# Altium schematic sheet PowerModul.SchDoc
size A3
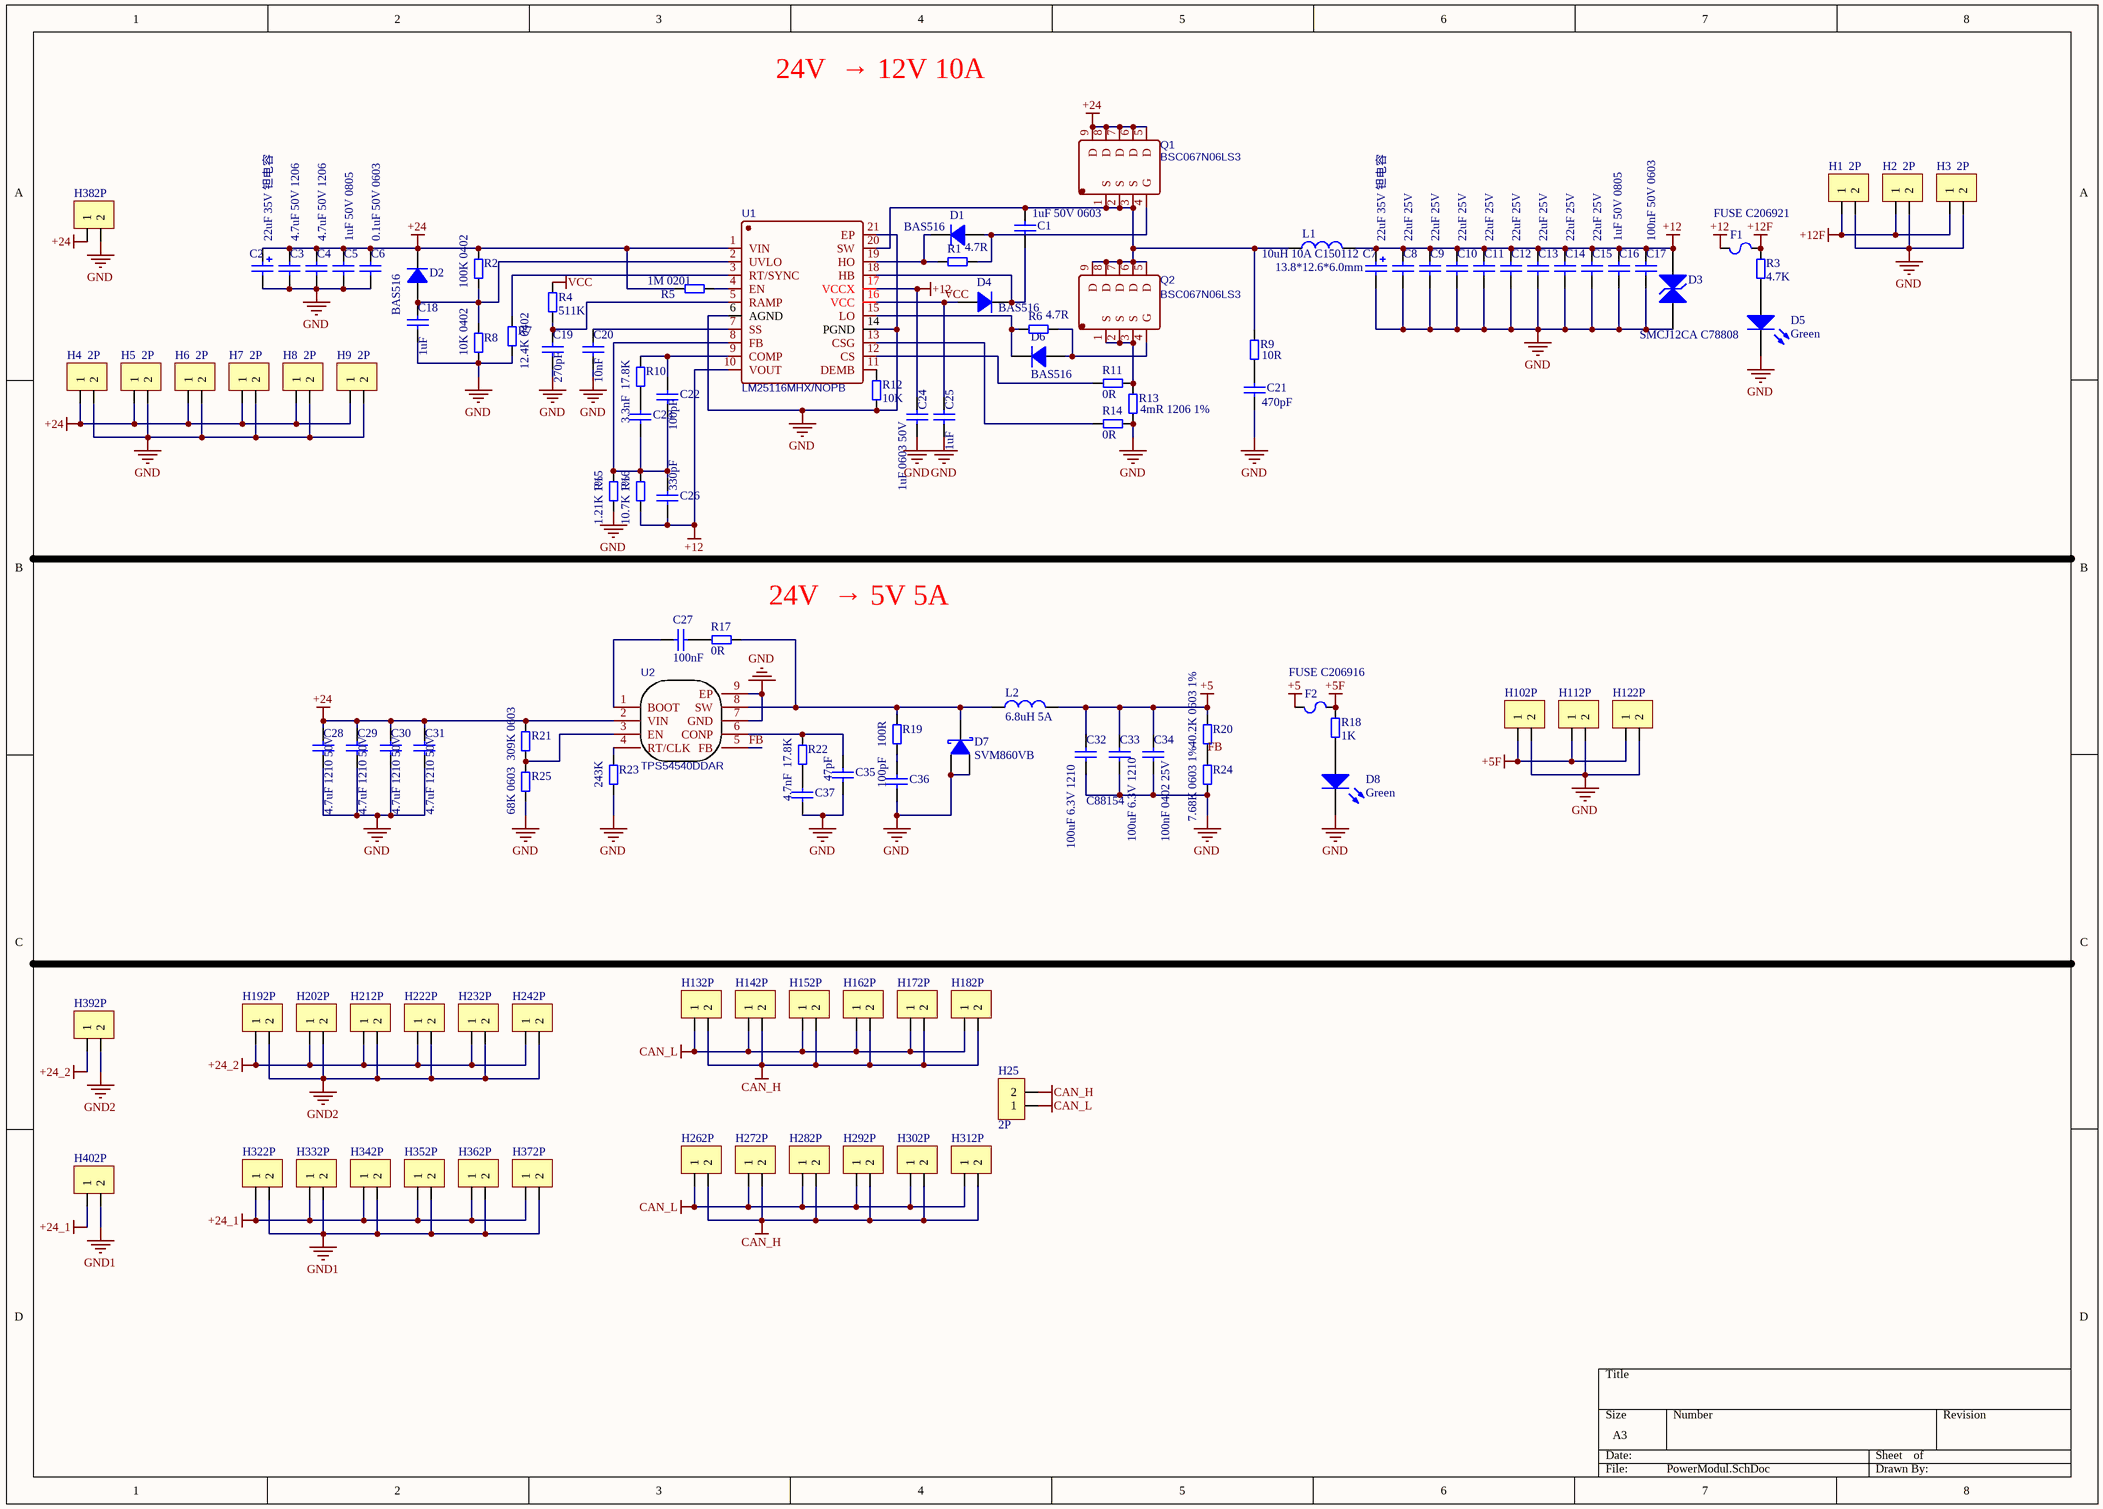
[diagram p0: PowerModul.SchDoc]

## Parts
C1  1uF 50V 0603  [0603_C]
C2  22uF 35V 钽电容  [CAP-SMD_L7.3-W4.3-R-RD]
C3  4.7uF 50V 1206  [1206_C]
C4  4.7uF 50V 1206  [1206_C]
C5  1uF 50V 0805  [0805_C]
C6  0.1uF 50V 0603  [0603_C]
C7  22uF 35V 钽电容  [CAP-SMD_L7.3-W4.3-R-RD]
C8  22uF 25V  [1206_C]
C9  22uF 25V  [1206_C]
C10  22uF 25V  [1206_C]
C11  22uF 25V  [1206_C]
C12  22uF 25V  [1206_C]
C13  22uF 25V  [1206_C]
C14  22uF 25V  [1206_C]
C15  22uF 25V  [1206_C]
C16  1uF 50V 0805  [0805_C]
C17  100nF 50V 0603  [0603_C]
C18  1uF  [0402_C]
C19  270pF  [0402_C]
C20  10nF  [0402_C]
C21  470pF  [0402_C]
C22  100pF  [0402_C]
C23  3.3nF  [0402_C]
C24  1uF 0603 50V  [0603_C]
C25  1uF  [0402_C]
C26  330pF  [0402_C]
C27  100nF  [0402_C]
C28  4.7uF 1210 50V  [C1210]
C29  4.7uF 1210 50V  [C1210]
C30  4.7uF 1210 50V  [C1210]
C31  4.7uF 1210 50V  [C1210]
C32  100uF 6.3V 1210  [C1210]
C33  100uF 6.3V 1210  [C1210]
C34  100nF 0402 25V  [0402_C]
C35  47pF  [0603_C]
C36  100pF  [0603_C]
C37  4.7nF  [0603_C]
D1  BAS516  [SOD-523_L1.2-W0.8-LS1.6-RD]
D2  BAS516  [SOD-523_L1.2-W0.8-LS1.6-RD]
D3  SMCJ12CA C78808  [SMC_L6.9-W5.9-LS7.9-BI]
D4  BAS516  [SOD-523_L1.2-W0.8-LS1.6-RD]
D5  Green  [0805_LED_S1]
D6  BAS516  [SOD-523_L1.2-W0.8-LS1.6-RD]
D7  SVM860VB  [TO-277B_3P-L6.1-W4.3-LS7.0-BR]
D8  Green  [0805_LED_S1]
F1  FUSE C206921  [FUSE-SMD_L9.8-W5.1]
F2  FUSE C206916  [FUSE-SMD_L9.8-W5.1]
H1  2P  [XT30UPB-F]
H2  2P  [XT30UPB-F]
H3  2P  [XT30UPB-F]
H4  2P  [XT30UPB-F]
H5  2P  [XT30UPB-F]
H6  2P  [XT30UPB-F]
H7  2P  [XT30UPB-F]
H8  2P  [XT30UPB-F]
H9  2P  [XT30UPB-F]
H10  2P  [XT30UPB-F]
H11  2P  [XT30UPB-F]
H12  2P  [XT30UPB-F]
H13  2P  [GH1.25-S-2P]
H14  2P  [GH1.25-S-2P]
H15  2P  [GH1.25-S-2P]
H16  2P  [GH1.25-S-2P]
H17  2P  [GH1.25-S-2P]
H18  2P  [GH1.25-S-2P]
H19  2P  [TX60-LI-P]
H20  2P  [TX60-LI-P]
H21  2P  [TX60-LI-P]
H22  2P  [TX60-LI-P]
H23  2P  [TX60-LI-P]
H24  2P  [TX60-LI-P]
H25  2P  [GH1.25-S-2P]
H26  2P  [GH1.25-S-2P]
H27  2P  [GH1.25-S-2P]
H28  2P  [GH1.25-S-2P]
H29  2P  [GH1.25-S-2P]
H30  2P  [GH1.25-S-2P]
H31  2P  [GH1.25-S-2P]
H32  2P  [TX60-LI-P]
H33  2P  [TX60-LI-P]
H34  2P  [TX60-LI-P]
H35  2P  [TX60-LI-P]
H36  2P  [TX60-LI-P]
H37  2P  [TX60-LI-P]
H38  2P  [TX60PW-M20]
H39  2P  [TX60PW-M20]
H40  2P  [TX60PW-M20]
L1  10uH 10A C150112  [IND-SMD_L13.8-W12.6_SMMS1360]
L2  6.8uH 5A  [IND-SMD_L7.1-W6.6]
Q1  BSC067N06LS3  [PG-TDSON-8_L5.0-W6.0-P1.27-LS6.2-BL-EP]
Q2  BSC067N06LS3  [PG-TDSON-8_L5.0-W6.0-P1.27-LS6.2-BL-EP]
R1  4.7R  [0402_R]
R2  100K 0402  [0402_R]
R3  4.7K  [0402_R]
R4  511K  [0402_R]
R5  1M 0201  [0402_R]
R6  4.7R  [0402_R]
R7  12.4K 0402  [0402_R]
R8  10K 0402  [0402_R]
R9  10R  [0402_R]
R10  17.8K  [0402_R]
R11  0R  [0402_R]
R12  10K  [0402_R]
R13  4mR 1206 1%  [1206_R]
R14  0R  [0402_R]
R15  1.21K 1%  [0402_R]
R16  10.7K 1%  [0402_R]
R17  0R  [0402_R]
R18  1K  [0402_R]
R19  100R  [0402_R]
R20  40.2K 0603 1%  [0603_R]
R21  309K 0603  [0603_R]
R22  17.8K  [0402_R]
R23  243K  [0402_R]
R24  7.68K 0603 1%  [0603_R]
R25  68K 0603  [0603_R]
U1  LM25116MHX/NOPB  [HTSSOP-20_L6.5-W4.4-P0.65-LS6.4-BL-EP]
U2  TPS54540DDAR  [SOIC-8-EP]

## Nets
+5: C32.2 C33.2 C34.2 F2.1 L2.2 R20.1
+5F: F2.2 H10.1 H11.1 H12.1 R18.1
+12: C7.1 C8.2 C9.2 C10.2 C11.2 C12.2 C13.2 C14.2 C15.2 C16.2 C17.2 C24.2 C26.1 D3.2(K) F1.1 L1.2 R16.2 U1.10(VOUT) U1.17(VCCX)
+12F: F1.2 H1.1 H2.1 H3.1 R3.1
+24: C2.1 C3.2 C4.2 C5.2 C6.2 C28.2 C29.2 C30.2 C31.2 D2.2(K) H4.1 H5.1 H6.1 H7.1 H8.1 H9.1 H38.1 Q1.5(D) Q1.6(D) Q1.7(D) Q1.8(D) Q1.9(D) R2.2 R5.2 R21.2 U1.1(VIN) U2.2(VIN)
+24_1: H32.1 H33.1 H34.1 H35.1 H36.1 H37.1 H40.1
+24_2: H19.1 H20.1 H21.1 H22.1 H23.1 H24.1 H39.1
CAN_H: H13.2 H14.2 H15.2 H16.2 H17.2 H18.2 H25.2 H26.2 H27.2 H28.2 H29.2 H30.2 H31.2
CAN_L: H13.1 H14.1 H15.1 H16.1 H17.1 H18.1 H25.1 H26.1 H27.1 H28.1 H29.1 H30.1 H31.1
GND: C2.2 C3.1 C4.1 C5.1 C6.1 C7.2 C8.1 C9.1 C10.1 C11.1 C12.1 C13.1 C14.1 C15.1 C16.1 C17.1 C18.1 C19.1 C20.1 C21.1 C24.1 C25.1 C28.1 C29.1 C30.1 C31.1 C32.1 C33.1 C34.1 C35.1 C36.1 C37.1 D3.1(A) D5.K D7.1(A) D7.2(A) D8.K H1.2 H2.2 H3.2 H4.2 H5.2 H6.2 H7.2 H8.2 H9.2 H10.2 H11.2 H12.2 H38.2 R7.1 R8.1 R12.1 R13.2 R14.2 R15.1 R23.1 R24.2 R25.1 U1.6(AGND) U1.14(PGND) U1.21(EP) U2.7(GND) U2.9(EP)
GND1: H32.2 H33.2 H34.2 H35.2 H36.2 H37.2 H40.2
GND2: H19.2 H20.2 H21.2 H22.2 H23.2 H24.2 H39.2
VCC: C25.2 D4.1(A) R4.2 U1.16(VCC)
FB: R20.2 R24.1 U2.5(FB)
NetC1_1: C1.1 D4.2(K) U1.18(HB)
NetC1_2: C1.2 L1.1 Q1.1(S) Q1.2(S) Q1.3(S) Q2.5(D) Q2.6(D) Q2.7(D) Q2.8(D) Q2.9(D) R9.1 U1.20(SW)
NetC18_2: C18.2 D2.1(A) R2.1 R8.2 U1.2(UVLO)
NetC19_2: C19.2 R4.1 U1.5(RAMP)
NetC20_2: C20.2 U1.7(SS)
NetC21_2: C21.2 R9.2
NetC22_1: C22.1 C23.1 C26.2 R15.2 R16.1 U1.8(FB)
NetC22_2: C22.2 R10.1 U1.9(COMP)
NetC23_2: C23.2 R10.2
NetC27_1: C27.1 R17.1
NetC27_2: C27.2 U2.1(BOOT)
NetC35_2: C35.2 R22.1 U2.6(CONP)
NetC36_2: C36.2 R19.2
NetC37_2: C37.2 R22.2
NetD1_1: D1.1(A) Q1.4(G) R1.1
NetD1_2: D1.2(K) R1.2 U1.19(HO)
NetD5_A: D5.A R3.2
NetD6_1: D6.1(A) Q2.4(G) R6.1
NetD6_2: D6.2(K) R6.2 U1.15(LO)
NetD7_3: D7.3(K) L2.1 R17.2 R19.1 U2.8(SW)
NetD8_A: D8.A R18.2
NetQ2_1: Q2.1(S) Q2.2(S) Q2.3(S) R11.2 R13.1
NetR5_1: R5.1 U1.4(EN)
NetR7_2: R7.2 U1.3(RT/SYNC)
NetR11_1: R11.1 U1.12(CS)
NetR12_2: R12.2 U1.11(DEMB)
NetR14_1: R14.1 U1.13(CSG)
NetR21_1: R21.1 R25.2 U2.3(EN)
NetR23_2: R23.2 U2.4(RT/CLK)

## Notes on the sheet
- 24V  → 12V 10A
- 13.8*12.6*6.0mm
- (near R17) 24V  → 5V 5A
- C88154

## Library data of the parts
C1 C3-C6 C8-C37 = C: 贴片电容; ComponentLink1Description: 供应商链接; ComponentLink1URL: http://www.szlcsc.com/product/details_2220.html; Package: 1206; Supplier: LC; SuppliersPartNumber: C1868
C2 C7 = Cp: 极性电容; Package: 3216; Supplier: LC; SuppliersPartNumber: C7171
  C2: ComponentLink2Description: C122325; ComponentLink2URL: C122325
  C7: ComponentLink1Description: 供应商链接; ComponentLink1URL: http://www.szlcsc.com/product/details_7643.html
D1 D2 D4 D6 = D: 二极管; ComponentLink1Description: 供应商链接; ComponentLink1URL: http://www.szlcsc.com/product/details_2485.html; Package: SOD-323; Supplier: LC; SuppliersPartNumber: C2128
D3 = TVS: ComponentLink1Description: 供应商链接; ComponentLink1URL: http://www.szlcsc.com/product/details_79530.html; Package: SMB/DO-214AA; Supplier: LC; SuppliersPartNumber: C78395
D5 D8 = LED: 发光二极管; ComponentLink1Description: 供应商链接; ComponentLink1URL: http://www.szlcsc.com/product/details_2666.html; Package: 0805; Supplier: LC; SuppliersPartNumber: C2293
D7 = Ds3: 肖特基二极管
F1 F2 = FUSE: 熔断器
L1 L2 = L: 电感
Q1 Q2 = CSD18563Q5AT: BOM_Manufacturer: Texas Instruments; Contributor: LCSC; BOM_Supplier: LCSC; BOM_Supplier Part: C140227; BOM_Manufacturer Part: CSD18563Q5AT; spicePre: Q; spiceSymbolName: CSD18563Q5AT
R1-R25 = R: 贴片电阻
U1 = LM25116MHX/NOPB: BOM_Manufacturer: Texas Instruments; Contributor: LCSC; BOM_Supplier: LCSC; BOM_Supplier Part: C390951; BOM_Manufacturer Part: LM25116MHX/NOPB; spicePre: U; spiceSymbolName: LM25116MHX/NOPB
U2 = TPS54540DDAR: BOM_Manufacturer: TI; SMT Type: Extend; BOM_Supplier: LCSC; BOM_Manufacturer Part: TPS54540DDAR; BOM_Supplier Part: C95286; BOM_LCSC Assembly: Yes; spicePre: U; spiceSymbolName: TPS54540DDAR